# EAGLE design Adafruit MAX31856 (EAGLE 6.4)
COMPANY: ADAFRUIT INDUSTRIES; DRAWN: KTOWN; REV: A
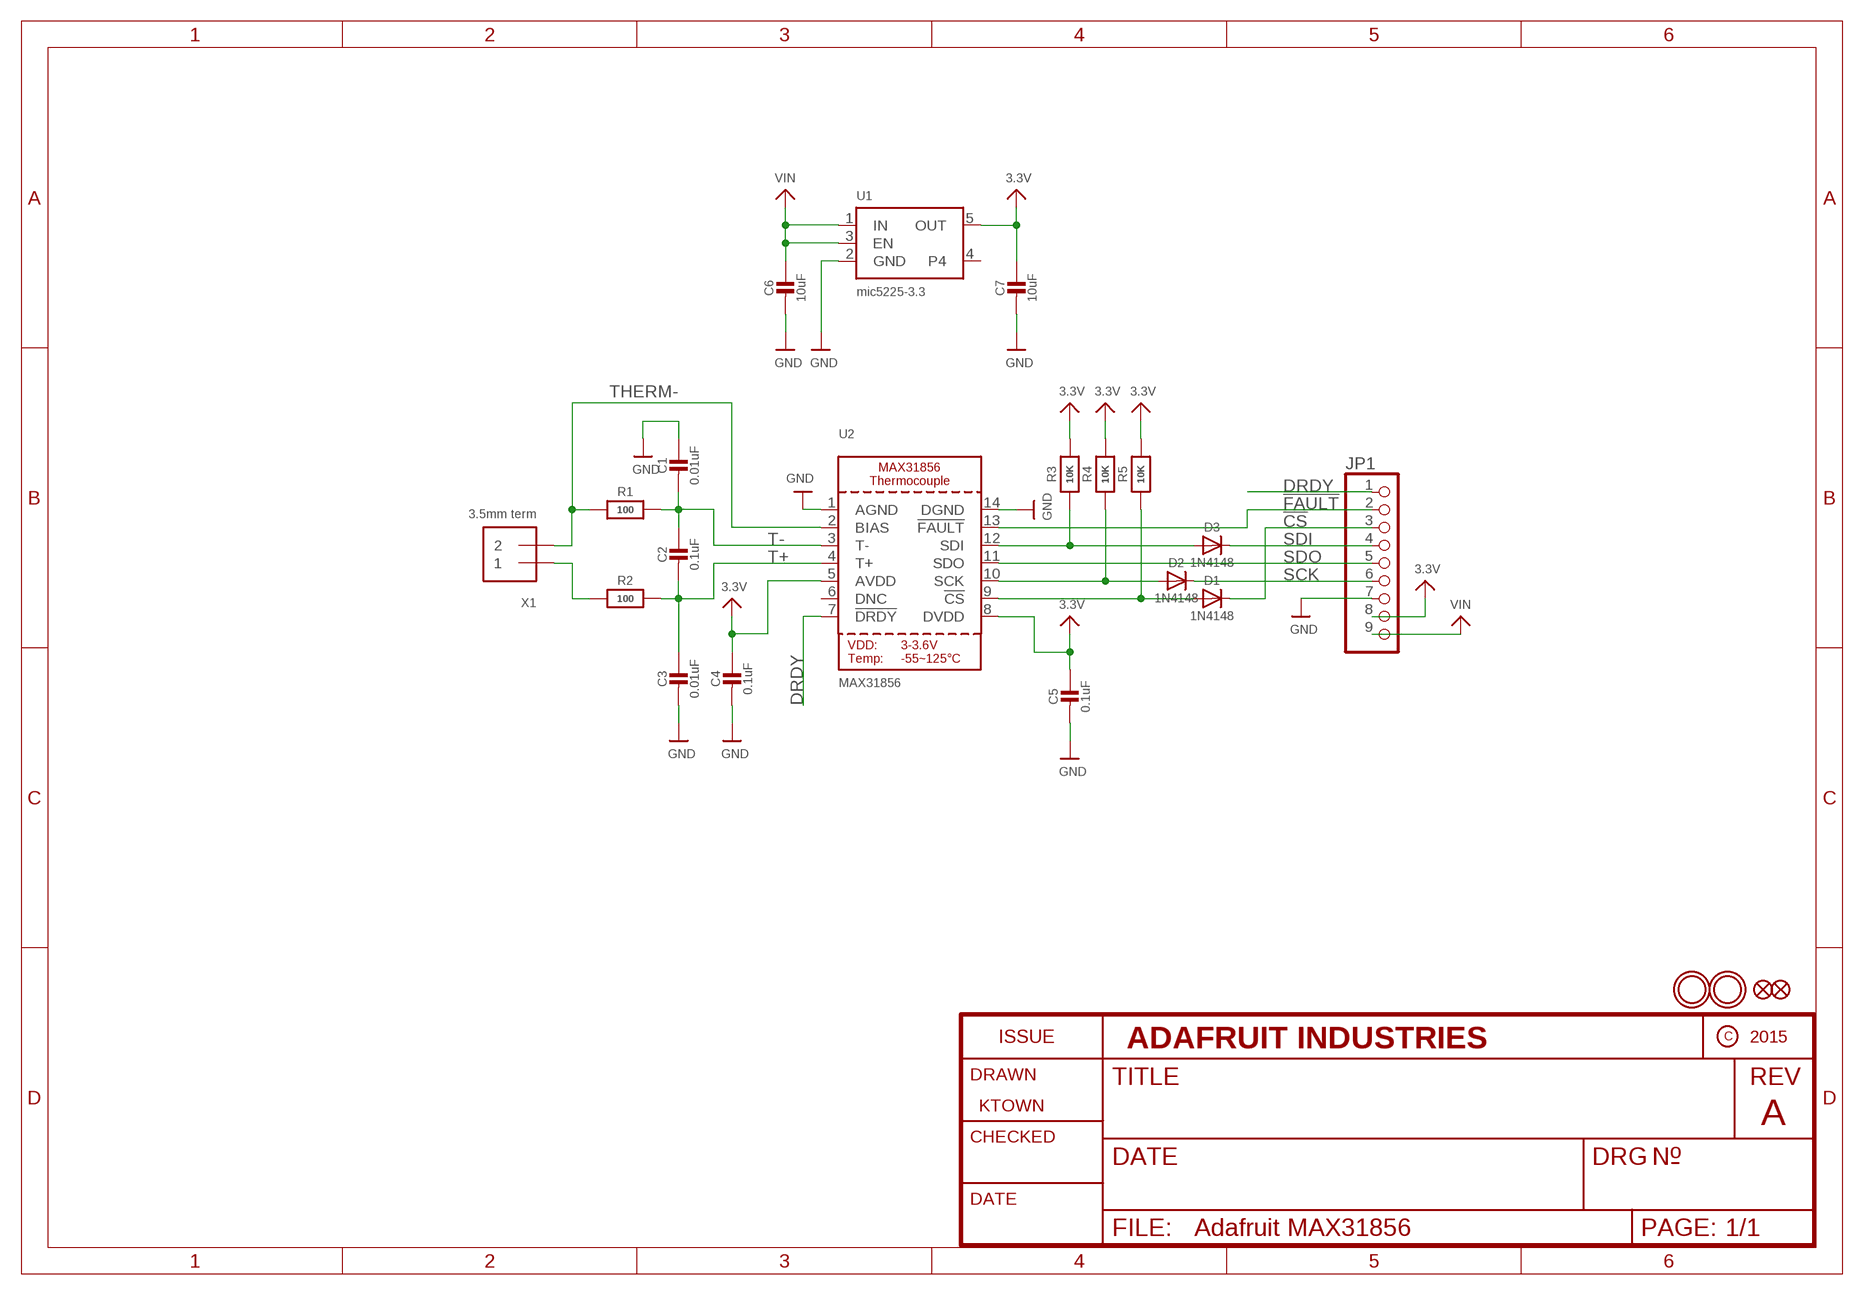
[diagram p0: schematic, sheet 1]

## Parts
C1  0.01uF  CAP_CERAMIC0805_10MGAP  [0805_10MGAP]
C2  0.1uF  CAP_CERAMIC0805-NOOUTLINE  [0805-NO]
C3  0.01uF  CAP_CERAMIC0805-NOOUTLINE  [0805-NO]
C4  0.1uF  CAP_CERAMIC0805-NOOUTLINE  [0805-NO]
C5  0.1uF  CAP_CERAMIC0805-NOOUTLINE  [0805-NO]
C6  10uF  CAP_CERAMIC0805-NOOUTLINE  [0805-NO]
C7  10uF  CAP_CERAMIC0805-NOOUTLINE  [0805-NO]
D1  1N4148  DIODESOD-323  [SOD-323]
D2  1N4148  DIODESOD-323  [SOD-323]
D3  1N4148  DIODESOD-323  [SOD-323]
FID1  FIDUCIAL""  [FIDUCIAL_1MM]
FID2  FIDUCIAL""  [FIDUCIAL_1MM]
JP1  HEADER-1X970MIL  [1X09_ROUND_70]
R1  100  RESISTOR0805_NOOUTLINE  [0805-NO]
R2  100  RESISTOR0805_NOOUTLINE  [0805-NO]
R3  10K  RESISTOR0805_NOOUTLINE  [0805-NO]
R4  10K  RESISTOR0805_NOOUTLINE  [0805-NO]
R5  10K  RESISTOR0805_NOOUTLINE  [0805-NO]
U1  mic5225-3.3  VREG_SOT23-5  [SOT23-5]
U2  MAX31856  [TSSOP14]
U$13  MOUNTINGHOLE2.5  [MOUNTINGHOLE_2.5_PLATED]
U$14  MOUNTINGHOLE2.5  [MOUNTINGHOLE_2.5_PLATED]
X1  3.5mm term  TERMBLOCK_1X2  [TERMBLOCK_1X2-3.5MM]

## Nets
3.3V: C4.1 C5.1 C7.1 JP1.8 R3.2 R4.2 R5.2 U1.5(OUT) U2.5(AVDD) U2.8(DVDD)
!CS: D1.C JP1.3
!CS_3V: D1.A R5.1 U2.9(!CS)
!FAULT: JP1.2 U2.13(!FAULT)
DRDY: JP1.1 U2.7(!DRDY)
GND: C1.1 C3.2 C4.2 C5.2 C6.2 C7.2 JP1.7 U1.2(GND) U2.1(AGND) U2.14(DGND)
SCK: D2.C JP1.6
SCK_3V: D2.A R4.1 U2.10(SCK)
SDI: D3.C JP1.4
SDO: JP1.5 U2.11(SDO)
SDO_3V: D3.A R3.1 U2.12(SDI)
T+: C2.2 C3.1 R2.2 U2.4(T+)
T-: C1.2 C2.1 R1.2 U2.3(T-)
THERM+: R2.1 X1.1
THERM-: R1.1 U2.2(BIAS) X1.2
VIN: C6.1 JP1.9 U1.1(IN) U1.3(EN)
Unconnected: U1.4 U2.6(DNC)

## Library data of the parts
C1-C7 = microbuilder:CAP_CERAMIC: Ceramic Capacitors For new designs, use the packages preceded by an '_' character since they are more reliable: The following footprints should be used on most boards: _0402 - Standard footprint for regular board layouts _0603 - Standard footprint for regular board layouts _0805 - Standard footprint for regular board layouts _1206 - Standard footprint for regular board layouts For extremely tight-pitch boards where space is at a premium, the following 'micro-pitch' footprints can be used (smaller pads, no silkscreen outline, etc.): _0402MP - Micro-pitch footprint for very dense/compact boards _0603MP - Micro-pitch footprint for very dense/compact boards _0805MP - Micro-pitch footprint for very dense/compact boards _1206MP - Micro-pitch footprint for very dense/compact boards
D1-D3 = microbuilder:DIODE: Diode SMA Model Volts Amps Type Vf Ir Digikey # Notes SSA34-E3 40V 3A Schottky 480mV @ 3A 200uA @ 40V SSA34-E3/61TGITR-ND CDBA120-G 20V 1A Schottky 500mV @ 1A 500uA @ 20V 641-1014-6-ND REEL MBRA210 10V 2A Schottky 350mV @ 2A 700uA @ 10V MBRA210LT3 SOD-123 Model Volts Amps Type Vf Ir Order # Notes BAT54T1G 30V 200mA Schottky 800mV @ 200mA 2uA @ 25V BAT54T1GOSTR-ND B0530W 30V 500mA Schottky 430mV @ 500mA 130uA @ 30V B0530W-FDICT-ND REEL MBR120 20V 1A Schottky 340mV @ 1A MBR120VLSFT1GOSCT-ND SOD-323 Model Volts Amps Type Vf Ir Order # Notes PMEG2005EJ 20V 500mA Schottky 355mV @ 500mA 568-4110-1-ND ZLLS410 10V 570mA Schottky 380mV @ 570mA ZLLS410CT-ND 1N4148WS 75V 150mA Silicon/Simple 1V 1N4148WSFSCT-ND REEL SOD-523 Model Volts Amps Type Vf Ir Order # Notes BAT54XV2 30V 200mA Schottky 0.8V @ 100mA BAT54XV2CT-ND TB751S 30V 30mA Schottky RB751S-40TE61CT-ND SOT23-R/W (R = Solder Paste/Reflow Ovens, W = Hand-Soldering) Model Volts Amps Type Vf Ir Order # Notes BAT54FILM 40V 300mA Schottky 497-7162-1-ND POWERDI-5 Model Volts Amps Type Vf Ir Order # Notes PDS560 60V 5A Schottky 670mV @ 5A 150uA @ 60V PDS560DICT-ND
FID1 FID2 = microbuilder:FIDUCIAL: Fiducial Alignment Points Various fiducial points for machine vision alignment.; BOM: EXCLUDE
JP1 = microbuilder:HEADER-1X9: PIN HEADER
R1-R5 = microbuilder:RESISTOR: Resistors For new designs, use the packages preceded by an '_' character since they are more reliable: The following footprints should be used on most boards: _0402 - Standard footprint for regular board layouts _0603 - Standard footprint for regular board layouts _0805 - Standard footprint for regular board layouts _1206 - Standard footprint for regular board layouts For extremely tight-pitch boards where space is at a premium, the following 'micro-pitch' footprints can be used (smaller pads, no silkscreen outline, etc.): _0402MP - Micro-pitch footprint for very dense/compact boards _0603MP - Micro-pitch footprint for very dense/compact boards _0805MP - Micro-pitch footprint for very dense/compact boards _1206MP - Micro-pitch footprint for very dense/compact boards
U1 = microbuilder:VREG_SOT23-5: SOT23-5 Fixed Voltage Regulators Part Current Out V Out V In V Dropout θJA (°C/W) TJ (°C) Digikey Part No. ADP121 150mA 3.3V 3.4-5.5V 0.09V @ 150mA -- -- ADP121-AUJZ33R7CT-ND ADP121 150mA 3.0V 3.1-5.5V 0.09V @ 150mA -- -- ADP121-AUJZ30R7CT-ND ADP122 300mA 3.3V 3.4-5.5V 0.085V @ 300mA -- -- ADP122AUJZ-3.3-R7CT-ND ADP1712 300mA 3.3V 3.5-5.5V 0.17V @ 300mA -- -- ADP1712AUJZ-3.3-R7TR-ND AP7311 (Low Cost) 150mA 3.3V 3.5-6V 0.15V @ 150mA -- -- AP7311-33WG-7DICT-ND LD39015M18R 150mA 1.8V 1.9V-5.5V 0.08V @ 100mA -- -- 497-6977-1-ND LP2985A-33DBVR 150mA 3.3V 3.3-16V 0.28V @ 150mA 206 150 296-18479-1-ND MCP1824T-3302E/OT 300mA 3.3V 3.5V-6V 0.2V @ 300mA -- -- MCP1824T-3302E/OTCT-ND MIC5205-2.5YM5 TR 150mA 2.5V 2.7-16V 0.165V @ 150mA -- -- 576-1257-2-ND MIC5205-3.0YM5 TR 150mA 3.0V 3.2V-16V 0.165V @ 150mA -- -- 576-1258-2-ND MIC5205-3.3YM5 TR 150mA 3.3V 3.5V-16V 0.165V @ 150mA -- -- 576-1259-2-ND TPS780330220 150mA 3.3V+2.2V 3.6-5.5V 250mV Max -- -- 296-23332-1-ND TDA3663/N1,135 100mA 3.3V 3.5-45V 0.18V @ 50mA -- -- 568-5343-1-ND Max operating temp can be calculated using θJA, TJ (max junction temperature), and power in watts. Set the "Maximum Ambient Temperature" until it reaches TJ ("Max Junction Temperature"), which is the absolute limit for safe use of the regulator: Heat Sink Temperature Calculator <http://www.daycounter.com/Calculators/Heat-Sink-Temperature-Calculator.phtml> For example, With 12V source into a 3.3V LP2985 and a 30mA load, we are dissipating (12V-3.3V) * 0.03A = 0.261W. With a θJA of 206 °C/W, a TJ of 150°C, and 261mW we can safely use the chip without a heat sink up to 75°C (=147.1°C Junction Temperature).
U2 = microbuilder:MAX31856: MAX31856 - Thermocouple Sensor ADC
U$13 U$14 = microbuilder:MOUNTINGHOLE: Mounting Hole For #2 screws (0.086"/2.18mm width, 0.094"/2.4mm hole) use 2.5mm; BOM: EXCLUDE
X1 = microbuilder:TERMBLOCK_1X2: 3.5mm Terminal block http://www.ladyada.net/library/pcb/eaglelibrary.html

## Board
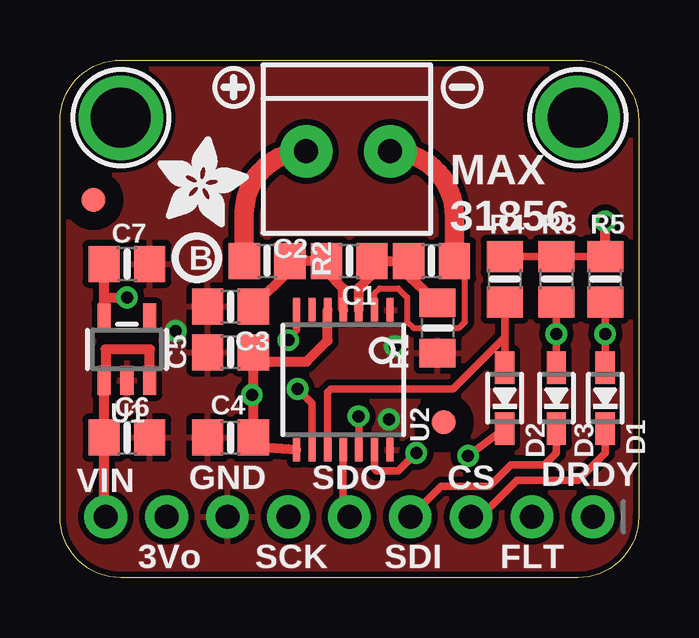
[diagram p1: board, top side]
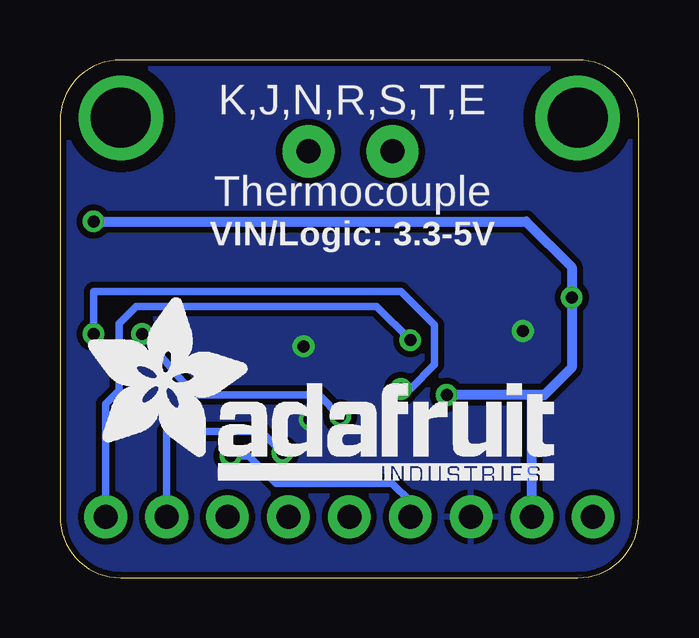
[diagram p2: board, bottom side, seen from below]

Size 24.13 x 21.59 mm. Coordinates in mm from the lower left corner, seen from the top.
Outline: 24.13,19.05 24.13,2.54 arc-90 21.59,0 2.54,0 arc-90 0,2.54 0,19.05 arc-90 2.54,21.59 21.59,21.59 arc-90 24.13,19.05
Copper layers (1*16): Top 0.035mm / dielectric 1.5mm / Bottom 0.035mm
Design rules "adafruit": minimum track width 8mil, minimum drill 15.5mil, track to track 8mil, track to pad 8mil, pad to pad 8mil, via to via 8mil, smd to smd 8mil, copper to edge 10mil, drill to drill 8mil, minimum pad ring 10mil, minimum via ring 8mil, stop-mask expansion 2mil, vias tented up to drill 20mil, thermal gap 10mil

### Footprints (pad centres in the part's own frame; a part is rotated, then mirrored left to right if it is on the bottom)
0805_10MGAP = smd 1.2 x 1.5: 1 -1.05,0; 2 1.05,0
0805-NO = smd 1.3 x 1.5: 1 -0.95,0; 2 0.95,0
SOD-323 = smd 1.35 x 0.8: A 1.27,0; C -1.27,0
FIDUCIAL_1MM = smd 1 x 1: 1 0,0
1X09_ROUND_70 = drill 1 pad 1.778: 1 -10.16,0; 2 -7.62,0; 3 -5.08,0; 4 -2.54,0; 5 0,0; 6 2.54,0; 7 5.08,0; 8 7.62,0; 9 10.16,0
SOT23-5 = smd 0.55 x 1.2: 1 -0.95,-1.3; 2 0,-1.3; 3 0.95,-1.3; 4 0.95,1.3; 5 -0.95,1.3
TSSOP14 = smd 0.305 x 0.991: 1 -1.95,-2.918; 2 -1.3,-2.918; 3 -0.65,-2.918; 4 0,-2.918; 5 0.65,-2.918; 6 1.3,-2.918; 7 1.95,-2.918; 8 1.95,2.918; 9 1.3,2.918; 10 0.65,2.918; 11 0,2.918; 12 -0.65,2.918; 13 -1.3,2.918; 14 -1.95,2.918
MOUNTINGHOLE_2.5_PLATED = drill 2.5 pad 3.2: P$1 0,0
TERMBLOCK_1X2-3.5MM = drill 1 pad 2.184: 1 1.8,0; 2 -1.7,0

### Placement (x,y rotation side)
C1  15.75,10.41 90 top
C2  12.06,13.21 180 top
C3  7.11,11.3 180 top
C4  7.11,5.84 180 top
C5  7.11,9.4 180 top
C6  2.79,5.84 0 top
C7  2.79,13.08 0 top
D1  22.73,7.49 90 top
D2  18.54,7.49 90 top
D3  20.7,7.49 90 top
FID1  16,6.48 0 top
FID2  1.4,15.75 0 top
JP1  12.06,2.54 180 top
R1  15.49,13.21 180 top
R2  8.64,13.21 0 top
R3  20.7,12.45 90 top
R4  18.54,12.45 90 top
R5  22.73,12.45 90 top
U1  2.79,9.53 0 top
U2  11.81,8.26 180 top
U$1  [PCBFEAT-REV-040]  5.71,13.34 0 top
U$13  2.54,19.18 0 top
U$14  21.59,19.18 0 top
U$23  [SYMBOL_PLUS]  7.24,20.45 0 top
U$24  [SYMBOL_MINUS]  16.76,20.45 0 top
U$25  [ADAFRUIT_3.5MM]  4.06,14.61 0 top
U$26  [ADAFRUIT_TEXT_20MM]  23.11,4.06 0 bottom
X1  12.06,17.78 180 top

### Tracks (layer width: path | path; a pad name or v marks a point on that pad's centre or on a via)
3.3V  (via drill 0.5)
  Top 0.305: R5.2 R3.2 R4.2
  Top 0.406: U1.5 1.84,11.68 | 1.84,11.68 C7.1 | 8.06,7.62 C5.1 8.44,9.02 10.29,9.02 11.16,9.89 U2.5 | 8.06,7.62 C4.1 8.06,5.46 U2.8 | v8,7.62 8.06,7.62 | 1.84,11.68 v2.79,11.68 | R5.2 v22.73,14.86
  Bottom 0.406: 4.45,7.62 3.94,7.62 2.79,8.76 v2.79,11.68 2.79,12.95 4.7,14.86 v22.73,14.86 | 4.45,7.62 v8,7.62 | JP1.8 4.45,7.62
!CS
  Top 0.305: D1.C 22.73,5.21 21.59,4.06 19.05,4.06 17.53,2.54 JP1.3
!CS_3V  (via drill 0.5)
  Top 0.305: R5.1 v22.73,10.16 D1.A | U2.9 10.51,7.27 v9.91,7.87
  Bottom 0.305: v9.91,7.87 9.53,7.87 8.51,8.89 8.51,10.54 9.91,11.94 22.73,11.94 v22.73,10.16
!FAULT  (via drill 0.5)
  Top 0.305: 14.48,4.83 v14.86,5.21 14.1,4.45 13.21,4.45 13.11,4.54 U2.13
  Bottom 0.305: v14.86,5.21 15.75,6.1 19.68,6.1 JP1.2
DRDY  (via drill 0.5)
  Top 0.305: v9.53,9.91 9.86,10.33 U2.7
  Bottom 0.305: JP1.1 22.23,7.24 21.65,7.81 21.65,10.6 20.95,11.3 10.92,11.3 v9.53,9.91
GND  (via drill 0.5)
  other vias: 13.72,6.6 13.97,9.65 4.83,10.29
  pour Top (isolate 0.254): 0,0 0,21.59 24.13,21.59 24.13,0
  pour Bottom (isolate 0.254): 0,0 0,21.59 24.13,21.59 24.13,0
SCK  (via drill 0.5)
  Top 0.305: D2.C v17.02,5.08
  Bottom 0.305: v17.02,5.08 16.26,5.08 15.11,3.94 14.86,3.94 10.29,3.94 9.53,3.17 JP1.6
SCK_3V
  Top 0.305: D2.A 18.54,10.03 | 18.54,10.03 R4.1 | 18.54,10.03 16.38,7.87 11.3,7.87 11.16,7.73 U2.10
SDI
  Top 0.305: D3.C 20.7,5.21 20.19,4.7 18.8,4.7 17.91,3.81 15.88,3.81 JP1.4
SDO
  Top 0.305: U2.11 11.81,2.79 JP1.5
SDO_3V  (via drill 0.5)
  Top 0.305: 20.7,10.67 R3.1 v20.7,10.16 D3.A | U2.12 12.46,6.72 v12.45,6.73
  Bottom 0.305: v12.45,6.73 13.34,7.62 18.54,7.62 v20.7,10.16
T+
  Top 0.406: U2.4 11.81,12.06 11.12,12.76 C2.2 R2.2 9.59,12.83 C3.1
T-
  Top 0.406: U2.3 12.46,12.08 12.95,12.57 12.95,13.02 C2.1 R1.2 14.54,12.57 C1.2
THERM+
  Top 0.813: R2.1 7.69,15.2 arc-90 X1.1
THERM-
  Top 0.254: U2.2 13.11,11.84 13.34,12.06 14.1,12.06 14.48,11.68 14.48,10.67 14.73,10.41 16.64,10.41 16.89,10.67 16.89,12.76 R1.1
  Top 0.813: R1.1 16.44,15.1 arc90 X1.2
VIN
  Top 0.406: JP1.9 1.84,2.6 C6.1 U1.1 1.91,8.22 1.91,9.53 3.74,9.53 U1.3

### Text on the board
tPlace: MAX / 31856 | VIN | GND | SDO | CS | DRDY | 3Vo | SCK | SDI | FLT
bPlace: K,J,N,R,S,T,E / / Thermocouple | VIN/Logic: 3.3-5V